# Altium schematic sheet POWER.SchDoc: WMI (POWER)
size A4
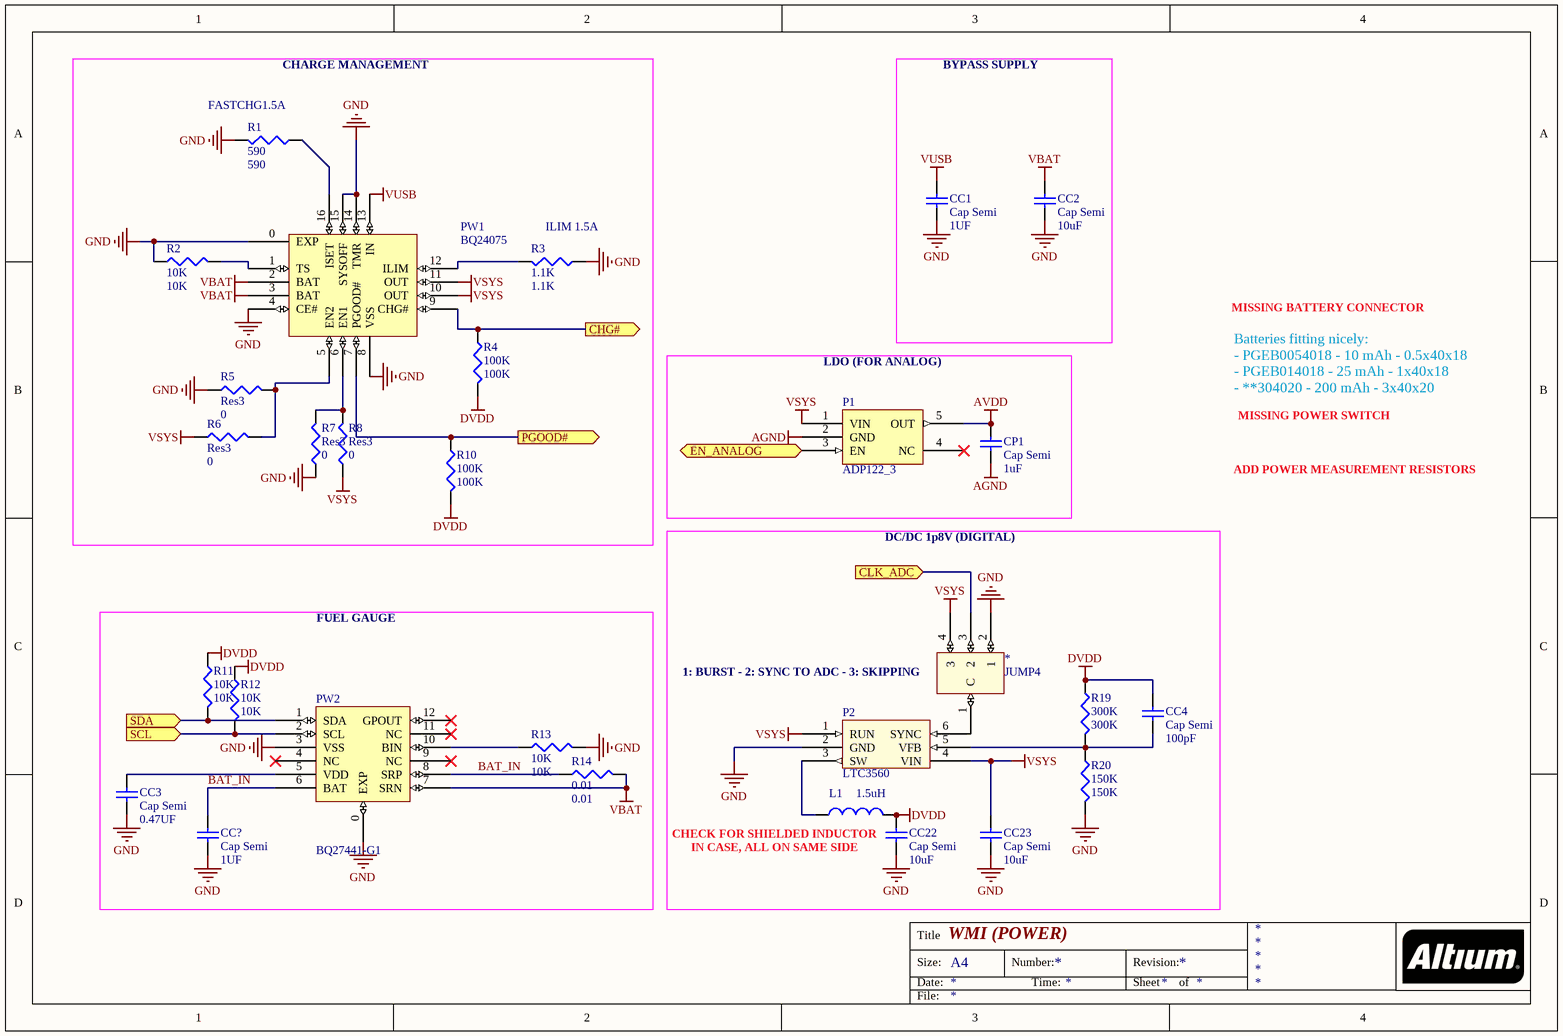
[diagram p0: POWER.SchDoc]

## Parts
*  JUMP4  [JMP4]
CC1  Cap Semi  value 1UF  [0402]
CC2  Cap Semi  value 10uF  [0402]
CC3  Cap Semi  value 0.47UF  [0402]
CC4  Cap Semi  value 100pF  [0402]
CC22  Cap Semi  value 10uF  [1608[0603]]
CC23  Cap Semi  value 10uF  [1608[0603]]
CC?  Cap Semi  value 1UF  [0402]
CP1  Cap Semi  value 1uF  [0402]
L1  value 1.5uH  [6-0805_N]
P1  ADP122_3  [UJ-5_N]
P2  LTC3560  [SOT23-6_N]
PW1  BQ24075  [RGT0016C_SMALL]
PW2  BQ27441-G1  [DRZ12_SMALL]
R1  590  [0402]
R2  10K  [0402]
R3  1.1K  [0402]
R4  100K  [0402]
R5  Res3  value 0  [0402]
R6  Res3  value 0  [0402]
R7  Res3  value 0  [0402]
R8  Res3  value 0  [0402]
R10  100K  [0402]
R11  10K  [0402]
R12  10K  [0402]
R13  10K  [0402]
R14  0.01  [0402]
R19  300K  [0402]
R20  150K  [0402]

## Blocks framed on the sheet
BYPASS SUPPLY: CC1 CC2
LDO (FOR ANALOG): CP1 P1
FUEL GAUGE: CC3 CC? PW2 R11-R14

## Ports
CHG# (out), CLK_ADC (in), EN_ANALOG (in), PGOOD# (out), SCL (in), SDA (in)

## Nets
AGND: CP1.1 P1.2(GND)
AVDD: CP1.2 P1.5(OUT)
DVDD: CC4.2 CC22.2 L1.2 R4.2 R10.2 R11.1 R12.1 R19.1
GND: *.2(1) CC1.1 CC2.1 CC3.1 CC22.1 CC23.1 CC?.1 P2.2(GND) PW1.0(EXP) PW1.4(CE#) PW1.8(VSS) PW1.14(TMR) PW1.15(SYSOFF) PW2.0(EXP) PW2.3(VSS) R1.2 R2.1 R3.1 R5.1 R7.1 R13.2 R20.2
VBAT: CC2.2 PW1.2(BAT) PW1.3(BAT) PW2.7(SRN) R14.2
VSYS: *.4(3) CC23.2 P1.1(VIN) P2.1(RUN) P2.4(VIN) PW1.10(OUT) PW1.11(OUT) R6.1 R8.1
VUSB: CC1.2 PW1.13(IN)
BAT_IN: CC?.2 PW2.6(BAT) PW2.8(SRP) R14.1
CHG#: PW1.9(CHG#) R4.1 ; port CHG#
CLK_ADC: *.3(2) ; port CLK_ADC
EN_ANALOG: P1.3(EN) ; port EN_ANALOG
PGOOD#: PW1.7(PGOOD#) R10.1 ; port PGOOD#
SCL: PW2.2(SCL) R12.2 ; port SCL
SDA: PW2.1(SDA) R11.2 ; port SDA
Net*_1: *.1(C) P2.6(SYNC)
NetCC3_2: CC3.2 PW2.5(VDD)
NetCC4_1: CC4.1 P2.5(VFB) R19.2 R20.1
NetL1_1: L1.1 P2.3(SW)
NetPW1_1: PW1.1(TS) R2.2
NetPW1_5: PW1.5(EN2) R5.2 R6.2
NetPW1_6: PW1.6(EN1) R7.2 R8.2
NetPW1_12: PW1.12(ILIM) R3.2
NetPW1_16: PW1.16(ISET) R1.1
NetPW2_10: PW2.10(BIN) R13.1

Not connected (* = marked no-connect by the designer): P1 4(NC)*; PW2 4(NC)* 9(NC)* 11(NC)* 12(GPOUT)*

## Notes on the sheet
- (near R1) FASTCHG1.5A
- CHARGE MANAGEMENT
- (near R3) ILIM 1.5A
- MISSING BATTERY CONNECTOR
- Batteries fitting nicely:
  - PGEB0054018 - 10 mAh - 0.5x40x18
  - PGEB014018 - 25 mAh - 1x40x18
  - **304020 - 200 mAh - 3x40x20
- MISSING POWER SWITCH
- ADD POWER MEASUREMENT RESISTORS
- DC/DC 1p8V (DIGITAL)
- (near *) 1: BURST - 2: SYNC TO ADC - 3: SKIPPING
- (near L1) CHECK FOR SHIELDED INDUCTOR
- (near L1) IN CASE, ALL ON SAME SIDE
- Title
- Size:
- Date:
- A4
- Number:
- Time:
- Revision:
- Sheet
- of
- File:

## Library data of the parts
CC1-CC4 CC22 CC23 CC? CP1 = Cap Semi: Capacitor (Semiconductor SIM Model); Published: 8-Jun-2000; LatestRevisionDate: 29-May-2009; LatestRevisionNote: IPC-7351 Footprint Added.; PackageReference: C1206; Publisher: Altium Limited; PackageDescription: Chip Capacitor
L1 = Inductor: Part Number: BRC2012T2R2MD; Manufacturer: Taiyo Yuden; PackageReference: 0805; PackageDescription: Chip Inductor; Digikey: 587-2905-1-ND
P1 = ADP122: Regulator
R1-R8 R10-R14 R19 R20 = Res3: Resistor; Published: 8-Jun-2000; LatestRevisionDate: 29-May-2009; LatestRevisionNote: IPC-7351 Footprint Added.; PackageReference: J1-0603; Publisher: Altium Limited; PackageDescription: Chip Resistor
  R1: Value: 590
  R2 R11-R13: Value: 10K
  R3: Value: 1.1K
  R4 R10: Value: 100K
  R14: Value: 0.01
  R19: Value: 300K
  R20: Value: 150K